# EAGLE design CurvedThumbs (EAGLE 9.0.1)
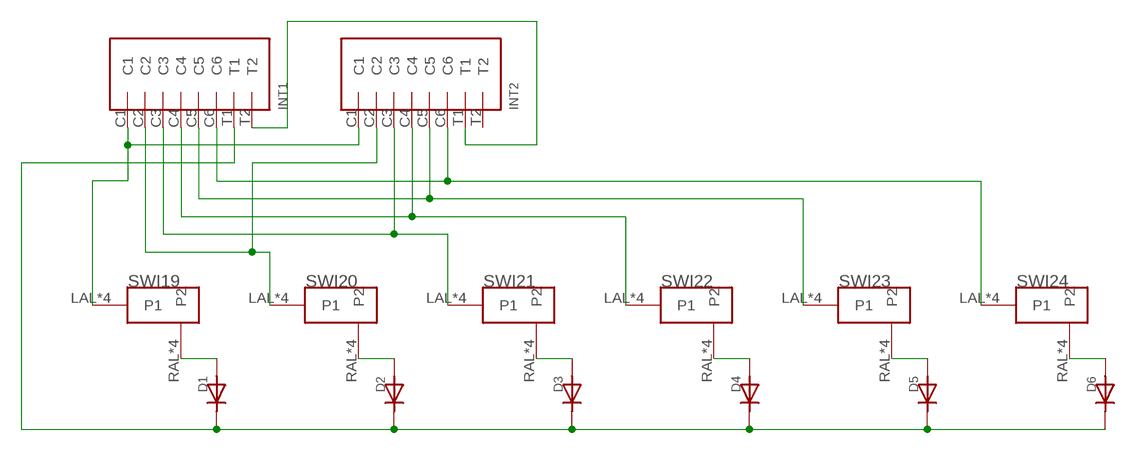
[diagram p0: schematic, sheet 1]

## Parts
D1  DIODE  [DIODE_COMBO]
D2  DIODE  [DIODE_COMBO]
D3  DIODE  [DIODE_COMBO]
D4  DIODE  [DIODE_COMBO]
D5  DIODE  [DIODE_COMBO]
D6  DIODE  [DIODE_COMBO]
INT1  INTRCNNT  [INTRCNNT]
INT2  INTRCNNT  [INTRCNNT]
SWI19  MX/ALPSDOUBLESIDED  [DOUBLED_MX/ALPS]
SWI20  MX/ALPSDOUBLESIDED  [DOUBLED_MX/ALPS]
SWI21  MX/ALPSDOUBLESIDED  [DOUBLED_MX/ALPS]
SWI22  MX/ALPSDOUBLESIDED  [DOUBLED_MX/ALPS]
SWI23  MX/ALPSDOUBLESIDED  [DOUBLED_MX/ALPS]
SWI24  MX/ALPSDOUBLESIDED  [DOUBLED_MX/ALPS]

## Nets
N$1: D1.ANOSB(AN) D1.ANOST(AN) D1.ANOT(AN) SWI19.RAL(P2) SWI19.RAR(P2) SWI19.RCL(P2) SWI19.RCR(P2)
N$2: D2.ANOSB(AN) D2.ANOST(AN) D2.ANOT(AN) SWI20.RAL(P2) SWI20.RAR(P2) SWI20.RCL(P2) SWI20.RCR(P2)
N$3: D3.ANOSB(AN) D3.ANOST(AN) D3.ANOT(AN) SWI21.RAL(P2) SWI21.RAR(P2) SWI21.RCL(P2) SWI21.RCR(P2)
N$4: D4.ANOSB(AN) D4.ANOST(AN) D4.ANOT(AN) SWI22.RAL(P2) SWI22.RAR(P2) SWI22.RCL(P2) SWI22.RCR(P2)
N$5: D5.ANOSB(AN) D5.ANOST(AN) D5.ANOT(AN) SWI23.RAL(P2) SWI23.RAR(P2) SWI23.RCL(P2) SWI23.RCR(P2)
N$6: D6.ANOSB(AN) D6.ANOST(AN) D6.ANOT(AN) SWI24.RAL(P2) SWI24.RAR(P2) SWI24.RCL(P2) SWI24.RCR(P2)
N$7: INT1.C1 INT2.C1 SWI19.LAL(P1) SWI19.LAR(P1) SWI19.LCL(P1) SWI19.LCR(P1)
N$8: INT1.C2 INT2.C2 SWI20.LAL(P1) SWI20.LAR(P1) SWI20.LCL(P1) SWI20.LCR(P1)
N$9: INT1.C3 INT2.C3 SWI21.LAL(P1) SWI21.LAR(P1) SWI21.LCL(P1) SWI21.LCR(P1)
N$10: INT1.C4 INT2.C4 SWI22.LAL(P1) SWI22.LAR(P1) SWI22.LCL(P1) SWI22.LCR(P1)
N$11: INT1.C5 INT2.C5 SWI23.LAL(P1) SWI23.LAR(P1) SWI23.LCL(P1) SWI23.LCR(P1)
N$12: INT1.C6 INT2.C6 SWI24.LAL(P1) SWI24.LAR(P1) SWI24.LCL(P1) SWI24.LCR(P1)
N$13: D1.CATSB(CAT) D1.CATST(CAT) D1.CATT(CAT) D2.CATSB(CAT) D2.CATST(CAT) D2.CATT(CAT) D3.CATSB(CAT) D3.CATST(CAT) D3.CATT(CAT) D4.CATSB(CAT) D4.CATST(CAT) D4.CATT(CAT) D5.CATSB(CAT) D5.CATST(CAT) D5.CATT(CAT) D6.CATSB(CAT) D6.CATST(CAT) D6.CATT(CAT) INT1.T1
N$14: INT1.T2 INT2.T1
Unconnected: INT2.T2

## Library data of the parts
D1-D6 = Keys:DIODE
INT1 INT2 = Keys:INTRCNNT
SWI19-SWI24 = Keys:MX/ALPS

## Board
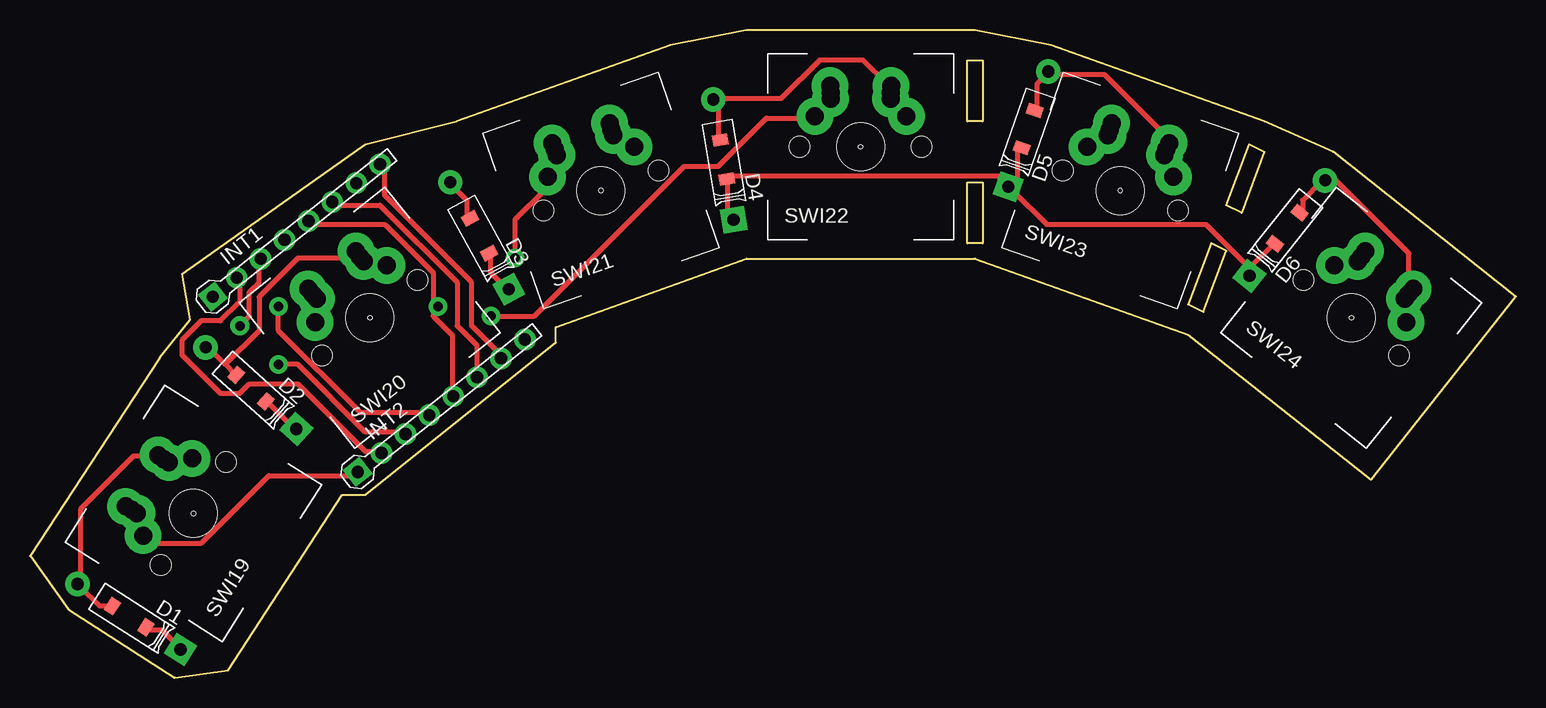
[diagram p1: board, top side]
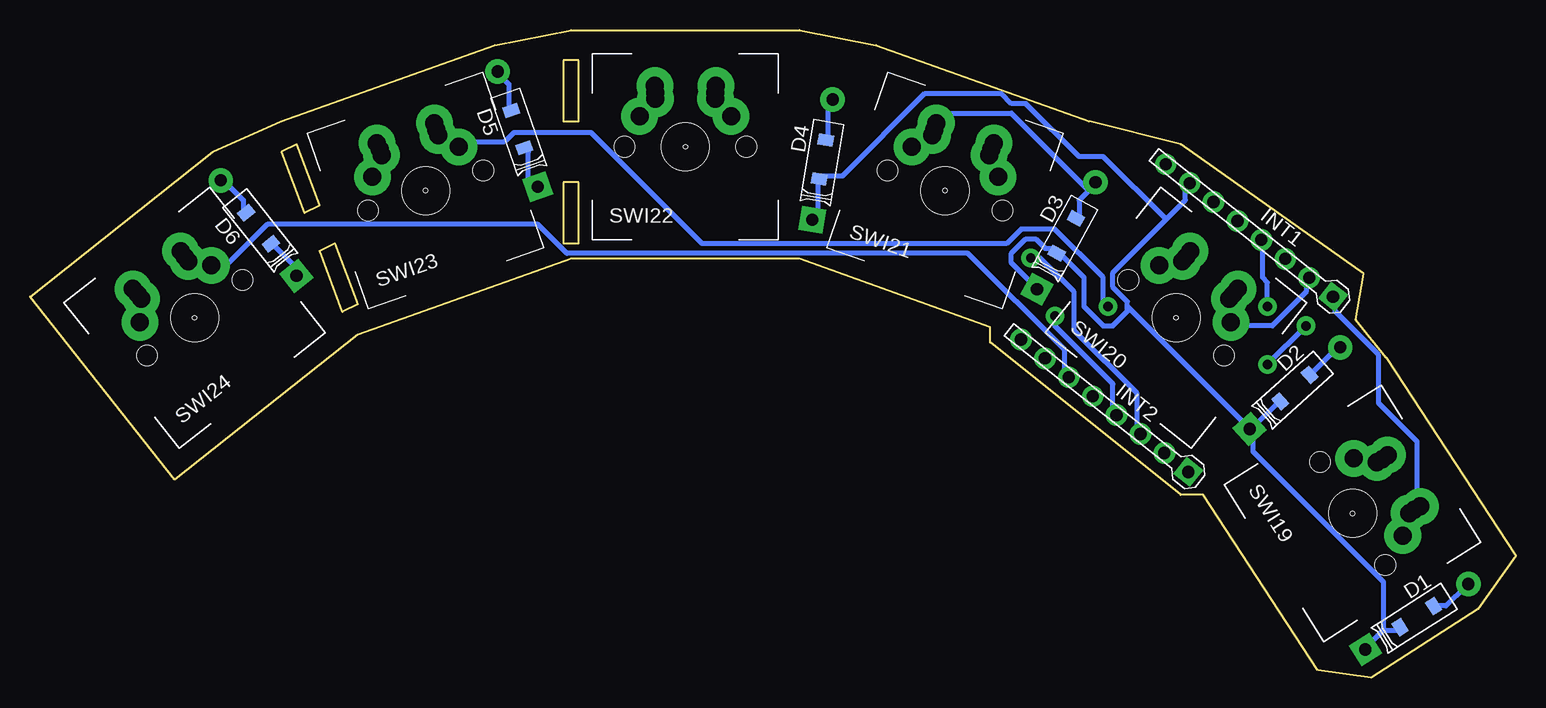
[diagram p2: board, bottom side, seen from below]

Size 123.82 x 53.97 mm. Coordinates in mm from the lower left corner, seen from the top.
Outline: 111.76,16.51 123.82,31.75 108.58,43.81 102.87,46.35 85.09,52.7 78.74,53.97 59.69,53.97 53.34,52.7 35.56,46.35 27.94,44.45 12.7,33.65 13.34,29.84 10.79,26.67 0,10.16 3.17,5.71 12.06,0 16.51,0.64 26.04,15.24 27.94,15.24 43.82,27.94 43.82,29.21 59.69,34.92 78.74,34.92 96.52,28.57 111.76,16.51
Outline: 79.38,51.43 79.38,46.35 78.1,46.35 78.1,51.43 79.38,51.43
Outline: 78.1,41.27 79.38,41.27 79.38,36.2 78.1,36.2 78.1,41.27
Outline: 101.6,44.45 102.87,43.81 100.96,38.73 99.69,39.37 101.6,44.45
Outline: 99.69,35.56 98.42,36.2 96.52,31.11 97.79,30.48 99.69,35.56
Copper layers (1*16): Top 0.035mm / dielectric 1.5mm / Bottom 0.035mm
Design rules "ModOthermill_1_64": minimum track width 16mil, minimum drill 31mil, track to track 0.39878125mm, track to pad 0.39878125mm, pad to pad 0.39878125mm, via to via 0.39878125mm, smd to smd 0mil, copper to edge 0mil, drill to drill 1mil, minimum pad ring 15mil, minimum via ring 15mil, stop-mask expansion 1mil, vias tented up to drill 30mil, thermal gap 10mil

### Footprints (pad centres in the part's own frame; a part is rotated, then mirrored left to right if it is on the bottom)
DIODE_COMBO = smd 0.914 x 1.27 bottom: ANOSB 1.651,0; CATSB -1.651,0 | smd 0.914 x 1.27: ANOST 1.651,0; CATST -1.651,0 | drill 1.016 pad 2.032: ANOT 5.08,0 | drill 1.016 pad 2.032 square: CATT -5.08,0
INTRCNNT = drill 1.016 square: C1 0,0 | drill 1.016: C2 2.54,0; C3 5.08,0; C4 7.62,0; C5 10.16,0; C6 12.7,0; T1 15.24,0; T2 17.78,0
DOUBLED_MX/ALPS = drill 1.5 pad 3.048: LAL -2.5,4; RAL 2.5,4 | drill 1.5: LAR -2.5,4.5; RAR 2.5,4.5 | drill 1.499 pad 3.048: LCL -3.81,2.54; LCR -2.54,5.08; RCL 3.81,2.54; RCR 2.54,5.08 | hole 0.35: 0,0 | hole 3.988: 0,0 | hole 1.702: -5.08,0; 5.08,0

### Placement (x,y rotation side)
D1  8.26,5.08 147.6 top
D2  18.41,24.13 138 top
D3  37.47,36.83 118.7 top
D4  57.79,43.18 99.6 top
D5  83.18,45.72 70.8 top
D6  104.77,37.46 51.6 top
INT1  15.24,31.75 38.4 top
INT2  27.3,17.14 38.4 top
SWI19  13.61,13.69 57.6 top
SWI20  28.32,30 38.4 top
SWI21  47.57,40.59 19.2 top
SWI22  69.21,44.25 0 top
SWI23  90.86,40.59 340.8 top
SWI24  110.11,30 321.6 top

### Tracks (layer width: path | path; a pad name or v marks a point on that pad's centre or on a via)
N$1
  Top 0.406: D1.ANOST 6.61,5.98 5.81,5.98 4.2,7.59 D1.ANOT 4.2,7.99 4.2,14.03 8.62,18.46 10.64,18.46 SWI19.RCR
  Bottom 0.406: D1.ANOST 6.61,5.98 5.81,5.98 4.2,7.59 D1.ANOT
N$2
  Top 0.406: 16.27,26.11 14.66,27.72 D2.ANOT | 16.27,26.11 17.08,25.3 D2.ANOST | 16.27,26.11 19.09,28.92 19.09,31.74 22.31,34.96 27.14,34.96 SWI20.RCR
  Bottom 0.406: D2.ANOST 17.08,25.3 14.66,27.72 D2.ANOT
N$3
  Top 0.406: D3.ANOST 36.4,38.59 36.4,39.79 35.2,41 D3.ANOT
  Bottom 0.406: 35.6,40.6 35.2,41 D3.ANOT 35.6,40.6 | 35.6,40.6 36.4,39.79 36.4,38.59 D3.ANOST | 35.6,40.6 42.04,47.04 47.27,47.04 48.08,46.24 SWI21.RCR
N$4
  Top 0.406: D4.ANOST 57.34,45.03 57.34,47.85 D4.ANOT 57.34,48.25 62.57,48.25 65.79,51.47 69.42,51.47 71.43,49.46 SWI22.RCR
  Bottom 0.406: D4.ANOST 57.34,45.03 57.34,47.85 D4.ANOT
N$5
  Top 0.406: D5.ANOST 83.91,47.44 83.91,49.46 84.71,50.26 D5.ANOT 85.12,50.26 89.55,50.26 95.18,44.62 SWI23.RAL
  Bottom 0.406: D5.ANOST 83.91,47.44 83.91,49.46 84.71,50.26 D5.ANOT
N$6
  Top 0.406: D6.ANOST 106.05,38.99 106.05,39.79 107.66,41.4 D6.ANOT 108.06,41.4 108.87,41.4 114.91,35.37 114.91,32.55 SWI24.RAL
  Bottom 0.406: D6.ANOST 106.05,38.99 106.05,39.79 107.66,41.4 D6.ANOT
N$7
  Top 0.406: INT2.C1 27.14,16.85 19.9,16.85 14.26,11.21 9.83,11.21 9.43,11.61 SWI19.LCL 9.03,12.02 9.03,13.63 SWI19.LCR | SWI19.LAL 8.62,14.03 SWI19.LAR
  Bottom 0.406: 8.22,14.43 8.22,19.66 11.44,22.89 11.44,26.91 15.07,30.54 15.07,31.74 INT1.C1 | 8.22,14.43 SWI19.LAR | 8.22,14.43 SWI19.LCR | 8.22,14.43 SWI19.LAL
N$8
  Top 0.406: 23.52,32.14 SWI20.LAL | SWI20.LCL 23.92,29.73 23.92,31.34 SWI20.LCR 23.52,32.14 | 23.52,32.14 SWI20.LAR | INT2.C2 29.16,18.86 27.95,18.86 22.31,24.5 18.29,24.5 17.48,23.69 15.87,23.69 12.65,26.91 12.65,28.12 14.26,29.73 15.87,29.73 17.48,31.34 17.48,32.95 INT1.C2
  Bottom 0.406: SWI20.LCL 23.52,29.33 20.3,29.33 17.48,32.14 17.48,32.95 INT1.C2
N$9  (via drill 0.79)
  Top 0.406: 43.65,44.22 SWI21.LAL | 43.65,44.22 SWI21.LCR | 43.65,44.22 SWI21.LAR 43.65,43.42 43.25,43.01 43.25,41.81 SWI21.LCL 42.84,41.4 42.84,40.6 40.43,38.18 v40.43,34.96 | v17.48,29.33 18.29,30.13 18.29,32.14 19.09,32.95 19.09,34.56 INT1.C3 | v20.7,26.11 22.31,26.11 27.95,20.47 31.17,20.47 INT2.C3
  Bottom 0.406: v20.7,26.11 v17.48,29.33 | v40.43,34.96 39.62,34.96 36.81,32.14 36.81,28.92 31.57,23.69 31.57,20.47 INT2.C3
N$10  (via drill 0.79)
  Top 0.406: SWI22.LAR 67,49.05 SWI22.LCR | SWI22.LAR 66.6,47.85 65.79,47.04 SWI22.LCL 65.39,46.64 61.36,46.64 57.34,42.61 54.52,42.61 42.04,30.13 v38.42,30.13 | SWI22.LAL 66.6,48.25 SWI22.LAR | v20.7,30.94 20.7,28.92 27.55,22.08 33.18,22.08 INT2.C4
  Bottom 0.406: v20.7,30.94 20.7,32.95 21.1,33.35 21.1,36.17 INT1.C4 | v38.42,30.13 38.42,29.33 33.59,24.5 33.59,22.08 INT2.C4
N$11  (via drill 0.79)
  Top 0.406: SWI23.LAR 89.95,45.83 SWI23.LCR | SWI23.LCL 88.34,44.62 89.14,44.62 89.55,45.03 SWI23.LAR | SWI23.LAL 89.95,45.43 SWI23.LAR | 33.59,30.94 33.59,33.75 29.56,37.78 23.52,37.78 INT1.C5 | 33.59,30.94 33.59,30.13 35.2,28.52 35.2,23.69 INT2.C5 | 33.59,30.94 v33.99,30.94
  Bottom 0.406: v33.99,30.94 34.39,31.34 34.39,33.35 38.42,37.38 41.23,37.38 42.44,36.17 67.8,36.17 77.06,45.43 83.51,45.43 84.31,44.62 87.93,44.62 SWI23.LCL
N$12
  Top 0.406: SWI24.LAR 110.88,35.37 SWI24.LAL | SWI24.LCL 108.87,34.56 110.48,34.56 SWI24.LAR | SWI24.LCR 111.28,35.37 SWI24.LAR | INT2.C6 37.21,25.3 37.21,27.72 35.6,29.33 35.6,32.95 29.16,39.39 25.53,39.39 INT1.C6
  Bottom 0.406: SWI24.LCL 108.47,34.56 107.26,34.56 104.04,37.78 81.49,37.78 79.08,35.37 45.66,35.37 37.61,27.31 37.61,25.3 INT2.C6
N$13
  Top 0.406: D4.CATT 58.55,38.18 58.14,38.59 58.14,41.4 D4.CATST 58.14,41.81 80.69,41.81 81.49,41 D5.CATT | 101.62,34.16 101.22,33.75 D6.CATT 101.62,34.16 | 101.62,34.16 103.64,36.17 D6.CATST | D5.CATST 82.3,43.82 82.3,41.4 81.9,41 D5.CATT | 101.62,34.16 98,37.78 84.71,37.78 81.9,40.6 D5.CATT | D1.CATST 9.83,3.96 11.04,3.96 12.25,2.76 D1.CATT | D2.CATST 19.9,22.89 21.91,20.87 D2.CATT | D3.CATST 38.42,35.37 38.42,33.75 39.62,32.55 D3.CATT
  Bottom 0.406: D4.CATT 58.55,38.18 58.14,38.59 58.14,41.4 D4.CATST 57.74,41.81 56.13,41.81 49.29,48.65 42.84,48.65 42.04,47.85 40.83,47.85 36.4,43.42 34.39,43.42 29.16,38.18 | D6.CATST 103.64,36.17 101.22,33.75 D6.CATT | D5.CATST 82.3,43.82 82.3,41.4 81.9,41 D5.CATT | 11.04,3.96 9.83,3.96 D1.CATST | 11.04,3.96 12.25,2.76 D1.CATT | D2.CATST 19.9,22.89 21.91,20.87 D2.CATT | D3.CATT 40.03,32.55 42.04,34.56 42.04,35.37 40.83,36.57 40.03,36.57 39.22,35.77 38.42,35.77 D3.CATST 38.01,35.37 36,33.35 36,30.94 34.39,29.33 33.59,29.33 32.38,30.54 32.38,30.94 | 29.16,38.18 33.59,33.75 33.59,32.55 32.38,31.34 32.38,30.94 | 29.16,38.18 27.55,39.79 27.55,41 INT1.T1 | 32.38,30.94 22.31,20.87 D2.CATT | 11.04,3.96 11.04,7.99 21.91,18.86 21.91,20.47 D2.CATT
N$14
  Top 0.406: INT1.T2 29.56,42.61 29.56,40.2 36.81,32.95 36.81,29.33 39.22,26.91 INT2.T1